# EAGLE design T07 -Schematic V3 (EAGLE 7.7.0)
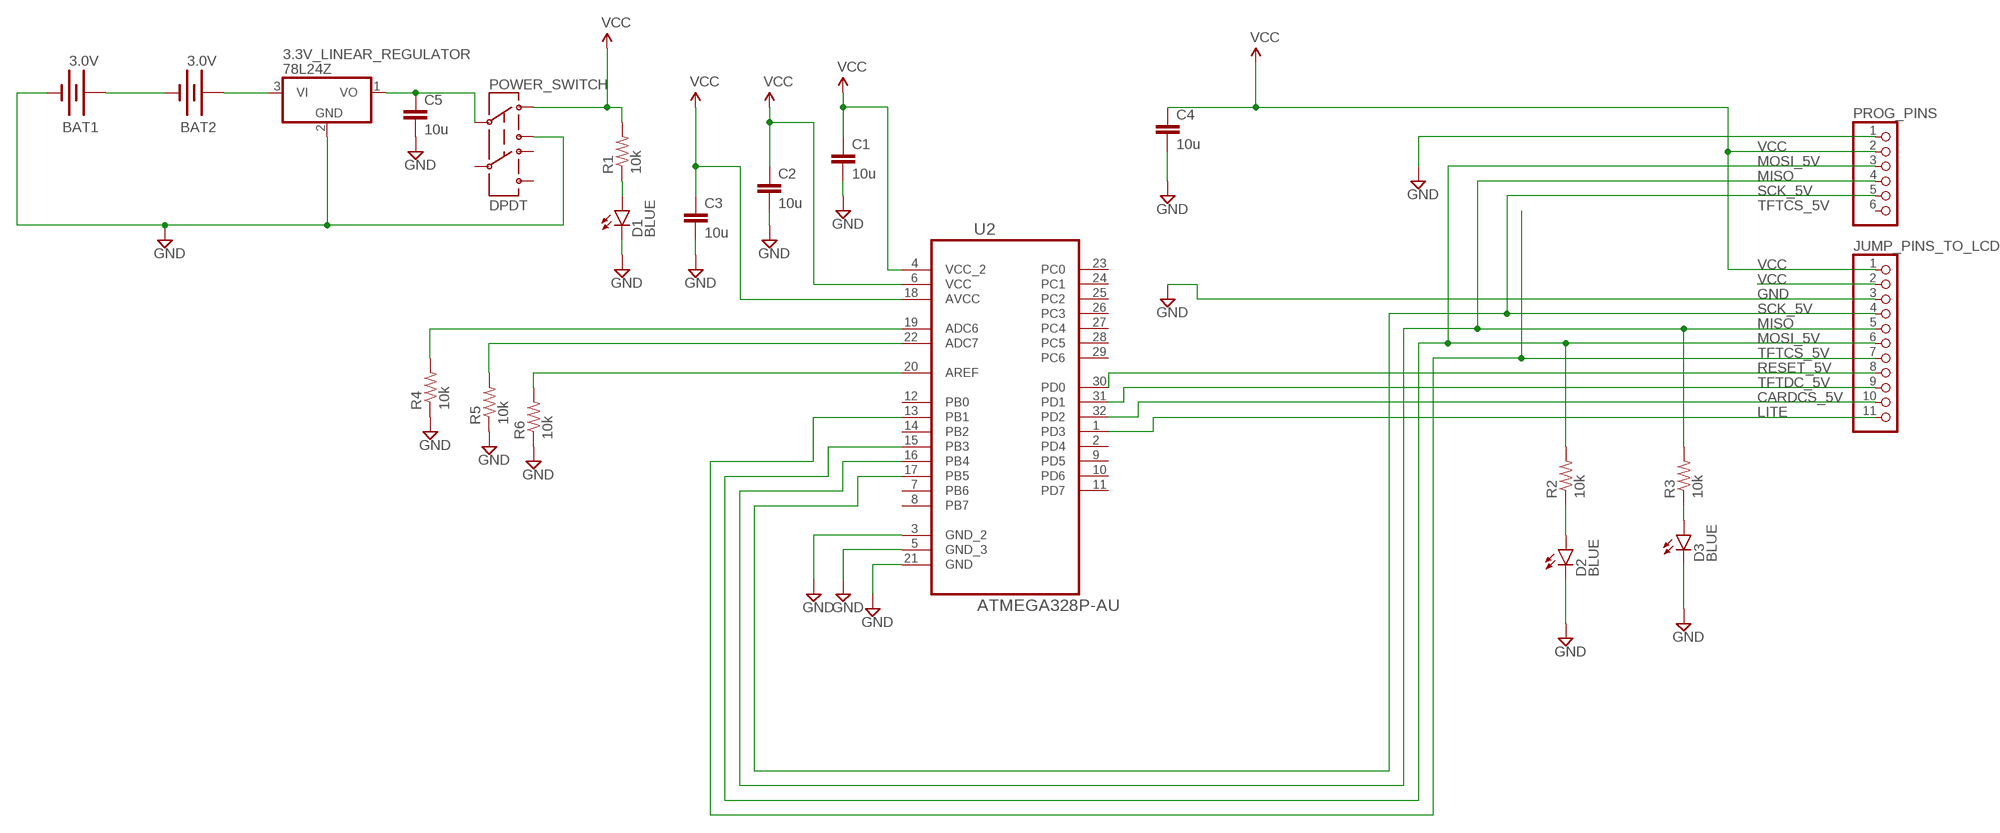
[diagram p0: schematic, sheet 1]

## Parts
3.3V_LINEAR_REGULATOR  78L24Z  [TO92]
BAT1  3.0V  BATTERY245PTH  [BATTCON_245MM_PTH]
BAT2  3.0V  BATTERY245PTH  [BATTCON_245MM_PTH]
C1  10u  CAP1206  [1206]
C2  10u  CAP1206  [1206]
C3  10u  CAP1206  [1206]
C4  10u  CAP1206  [1206]
C5  10u  CAP1206  [1206]
D1  BLUE  LED-BLUE1206  [LED-1206]
D2  BLUE  LED-BLUE1206  [LED-1206]
D3  BLUE  LED-BLUE1206  [LED-1206]
JUMP_PINS_TO_LCD  HEADER-1X1176MIL  [1X11_ROUND_76]
POWER_SWITCH  DPDT  SWITCH-DPDTAYZ0202  [AYZ0202]
PROG_PINS  PINHD-1X6-3.5MM  [1X06-3.5MM]
R1  10k  RESISTOR1206  [1206]
R2  10k  RESISTOR1206  [1206]
R3  10k  RESISTOR1206  [1206]
R4  10k  RESISTOR1206  [1206]
R5  10k  RESISTOR1206  [1206]
R6  10k  RESISTOR1206  [1206]
U2  ATMEGA328P-AU  [QFP80P900X900X120-32N]

## Nets
CARDCS_5V: JUMP_PINS_TO_LCD.10 U2.32(PD2)
GND: 3.3V_LINEAR_REGULATOR.2(GND) BAT1.2(-) C1.2 C2.2 C3.2 C4.2 C5.2 D1.C D2.C D3.C JUMP_PINS_TO_LCD.3 POWER_SWITCH.3 PROG_PINS.1 R4.1 R5.1 R6.1 U2.3(GND_2) U2.5(GND_3) U2.21(GND)
LITE: JUMP_PINS_TO_LCD.11 U2.1(PD3)
MISO: JUMP_PINS_TO_LCD.5 PROG_PINS.4 R3.2 U2.16(PB4)
MOSI_5V: JUMP_PINS_TO_LCD.6 PROG_PINS.3 R2.2 U2.15(PB3)
N$1: BAT1.3(+) BAT2.2(-)
N$2: 3.3V_LINEAR_REGULATOR.3(VI) BAT2.3(+)
N$3: D1.A R1.1
N$4: JUMP_PINS_TO_LCD.2
N$5: R4.2 U2.19(ADC6)
N$7: 3.3V_LINEAR_REGULATOR.1(VO) C5.1 POWER_SWITCH.2
N$8: D2.A R2.1
N$9: D3.A R3.1
N$10: R5.2 U2.22(ADC7)
N$11: R6.2 U2.20(AREF)
RESET_5V: JUMP_PINS_TO_LCD.8 U2.30(PD0)
SCK_5V: JUMP_PINS_TO_LCD.4 PROG_PINS.5 U2.17(PB5)
TFTCS_5V: JUMP_PINS_TO_LCD.7 U2.13(PB1)
TFTDC_5V: JUMP_PINS_TO_LCD.9 U2.31(PD1)
VCC: C1.1 C2.1 C3.1 C4.1 JUMP_PINS_TO_LCD.1 POWER_SWITCH.1 PROG_PINS.2 R1.2 U2.4(VCC_2) U2.6(VCC) U2.18(AVCC)
Unconnected: POWER_SWITCH.4 POWER_SWITCH.5 POWER_SWITCH.6 PROG_PINS.6 U2.2(PD4) U2.7(PB6) U2.8(PB7) U2.9(PD5) U2.10(PD6) U2.11(PD7) U2.12(PB0) U2.14(PB2) U2.23(PC0) U2.24(PC1) U2.25(PC2) U2.26(PC3) U2.27(PC4) U2.28(PC5) U2.29(PC6)

## Library data of the parts
3.3V_LINEAR_REGULATOR = adafruit:78*: Positive VOLTAGE REGULATOR Added bigger pads to the TO-92 package
BAT1 BAT2 = SparkFun-Electromechanical:BATTERY: Battery Holders Various common sizes : AA, AAA, 18650 (PRT-12895), 20mm coin cell and 12mm coin cell. 20MM_4LEGS, BATT-10373
C1-C5 = SparkFun-Capacitors:CAP: Capacitor Standard 0603 ceramic capacitor, and 0.1" leaded capacitor.
D1-D3 = SparkFun-LED:LED-BLUE: Blue LEDs for production use Various blue LEDs stocked by SparkFun production 0603 - DIO-08575 Rebel - DIO-09553 1206 - DIO-09911; PROD_ID: DIO-09911
JUMP_PINS_TO_LCD = microbuilder:HEADER-1X11
POWER_SWITCH = SparkFun-Electromechanical:SWITCH-DPDT: DPDT Version of the COM-00597; PROD_ID: SWCH-08179
PROG_PINS = adafruit:PINHD-1X6: PIN HEADER
R1-R6 = SparkFun-Resistors:RESISTOR: Resistor Basic schematic elements and footprints for 0603, 1206, and PTH resistors.
U2 = Atmel_By_element14_Batch_1-00:ATMEGA328P-AU: 8-bit Microcontroller with In-System Programmable Flash; MPN: ATMEGA328P-AU; OC_FARNELL: 1715486; OC_NEWARK: 14R4631; PACKAGE: TQFP-32; SUPPLIER: Atmel

## Net classes
1 power: width 0.406 mm

## Board
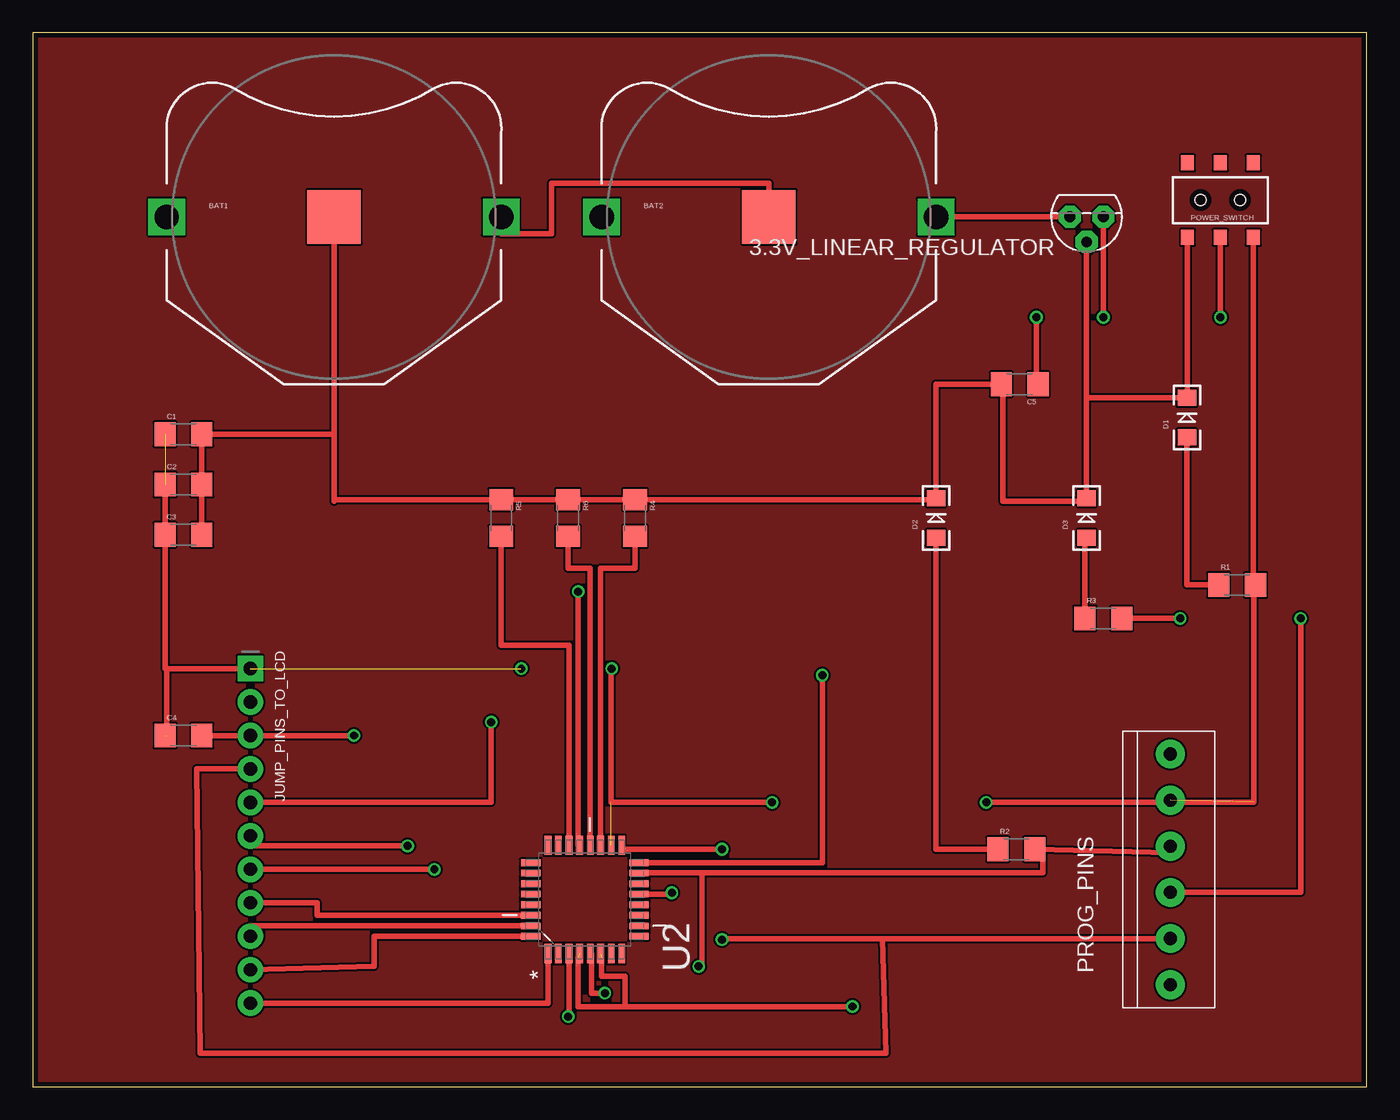
[diagram p1: board, top side]
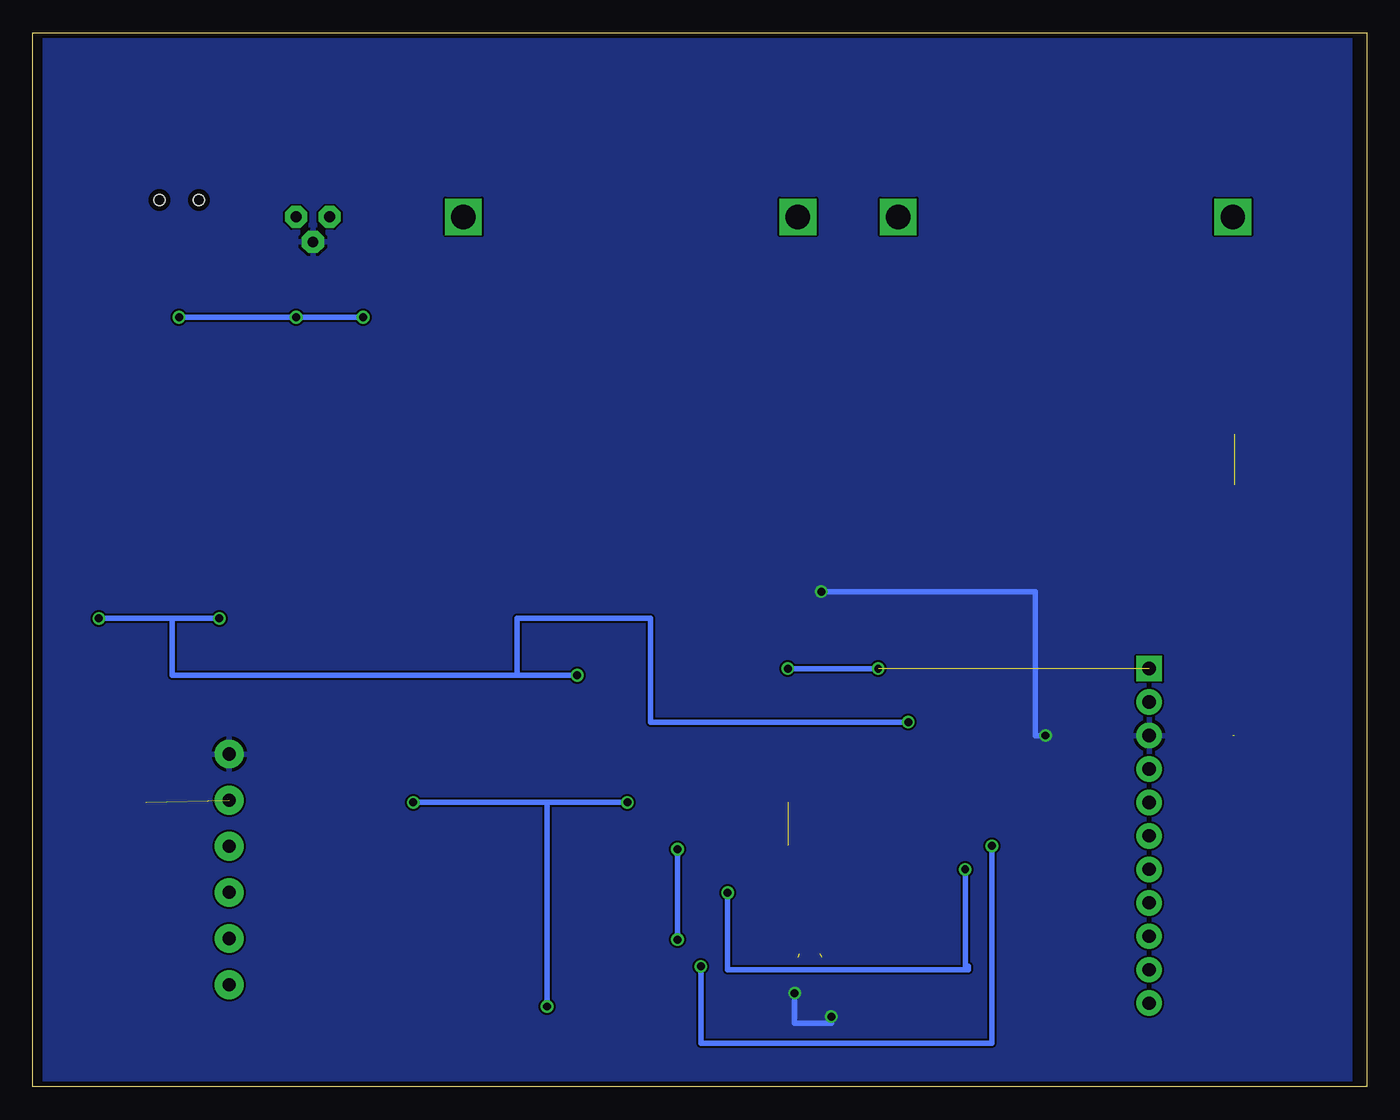
[diagram p2: board, bottom side, seen from below]

Size 101.27 x 80 mm. Coordinates in mm from the lower left corner, seen from the top.
Outline: 0,0 101.27,0 101.27,80 0,80 0,0
Copper layers (1*16): Top 0.0356mm / dielectric 1.5011mm / Bottom 0.0356mm
Design rules "tysons_rules": minimum track width 6mil, minimum drill 13mil, track to track 6mil, track to pad 6mil, pad to pad 6mil, via to via 6mil, smd to smd 6mil, copper to edge 15mil, drill to drill 6mil, minimum pad ring 7mil, minimum via ring 7mil, stop-mask expansion 2.5mil, vias tented up to drill 0mil, thermal gap 10mil

### Footprints (pad centres in the part's own frame; a part is rotated, then mirrored left to right if it is on the bottom)
TO92 = drill 0.813 pad 1.676 octagon: 1 -1.27,0; 2 0,1.905; 3 1.27,0
BATTCON_245MM_PTH = drill 1.854 square: 1 -12.7,0; 3 12.7,0 | smd 4.064 x 4.064: 2 0,0
1206 = smd 1.6 x 1.8: 1 -1.4,0; 2 1.4,0
LED-1206 = smd 1.2 x 1.4: A -1.5,0; C 1.5,0
1X11_ROUND_76 = drill 1 pad 1.93 square: 1 -12.7,0 | drill 1 pad 1.93: 2 -10.16,0; 3 -7.62,0; 4 -5.08,0; 5 -2.54,0; 6 0,0; 7 2.54,0; 8 5.08,0; 9 7.62,0; 10 10.16,0; 11 12.7,0
AYZ0202 = smd 1 x 1.15: 1 -2.5,2.825; 2 0,2.825; 3 2.5,2.825; 4 -2.5,-2.825; 5 0,-2.825; 6 2.5,-2.825 | hole 0.85: 1.5,0; -1.5,0
1X06-3.5MM = drill 1 pad 2.184: 1 -8.75,0; 2 -5.25,0; 3 -1.75,0; 4 1.75,0; 5 5.25,0; 6 8.75,0
QFP80P900X900X120-32N = smd 1.473 x 0.508: 1 -4.115,2.794; 2 -4.115,2.007; 3 -4.115,1.194; 4 -4.115,0.406; 5 -4.115,-0.406; 6 -4.115,-1.194; 7 -4.115,-2.007; 8 -4.115,-2.794; 17 4.115,-2.794; 18 4.115,-2.007; 19 4.115,-1.194; 20 4.115,-0.406; 21 4.115,0.406; 22 4.115,1.194; 23 4.115,2.007; 24 4.115,2.794 | smd 0.508 x 1.473: 9 -2.794,-4.115; 10 -2.007,-4.115; 11 -1.194,-4.115; 12 -0.406,-4.115; 13 0.406,-4.115; 14 1.194,-4.115; 15 2.007,-4.115; 16 2.794,-4.115; 25 2.794,4.115; 26 2.007,4.115; 27 1.194,4.115; 28 0.406,4.115; 29 -0.406,4.115; 30 -1.194,4.115; 31 -2.007,4.115; 32 -2.794,4.115

### Placement (x,y rotation side)
3.3V_LINEAR_REGULATOR  80.01,66.04 180 top
BAT1  22.86,66.04 0 top
BAT2  55.88,66.04 0 top
C1  11.43,49.53 0 top
C2  11.43,45.72 0 top
C3  11.43,41.91 0 top
C4  11.43,26.67 0 top
C5  74.93,53.34 180 top
D1  87.63,50.8 90 top
D2  68.58,43.18 90 top
D3  80.01,43.18 90 top
JUMP_PINS_TO_LCD  16.51,19.05 270 top
POWER_SWITCH  90.17,67.31 180 top
PROG_PINS  86.36,16.51 270 top
R1  91.44,38.1 0 top
R2  74.68,18.03 0 top
R3  81.28,35.56 0 top
R4  45.72,43.18 270 top
R5  35.56,43.18 270 top
R6  40.64,43.18 270 top
U2  41.91,14.22 90 top

### Tracks (layer width: path | path; a pad name or v marks a point on that pad's centre or on a via)
CARDCS_5V
  Top 0.406: U2.32 25.91,11.43 25.91,9.14 JUMP_PINS_TO_LCD.10
GND  (via drill 0.6)
  Top 0.406: BAT1.2 22.86,49.53 | 22.86,49.53 C1.2 | 12.7,49.53 C1.2 | C1.2 C2.2 C3.2 12.7,41.91 | 80.01,52.3 D1.C 87.67,52.3 POWER_SWITCH.3 87.67,64.14 | 80.01,52.3 D3.C 80.01,44.45 73.66,44.45 73.66,53.34 C5.2 68.58,53.34 D2.C 68.58,44.58 R4.1 R6.1 R5.1 22.86,44.58 | 3.3V_LINEAR_REGULATOR.2 80.01,52.3 | 22.86,44.58 22.86,44.45 | 22.86,44.58 22.86,49.53 | C4.2 JUMP_PINS_TO_LCD.3 v24.38,26.67 | U2.21 41.4,18.34 v41.4,37.59 | U2.5 42.42,10.11 42.42,7.11 v43.43,7.11 | v40.64,5.33 40.72,5.33 U2.3
  Bottom 0.406: v24.38,26.67 25.15,26.67 25.15,37.59 v41.4,37.59 | v43.43,7.11 43.43,4.83 40.64,4.83 v40.64,5.33
  pour Bottom: 1.27,80.01 100.33,80.01 100.33,0 1.27,0
LITE
  Top 0.406: U2.1 39.12,6.35 JUMP_PINS_TO_LCD.11
MISO  (via drill 0.6)
  Top 0.406: PROG_PINS.4 96.27,14.76 v96.27,35.56 | v87.12,35.56 R3.2 | U2.16 59.94,17.02 v59.94,31.24 | JUMP_PINS_TO_LCD.5 34.8,21.59 v34.8,27.69
  Bottom 0.406: v96.27,35.56 90.68,35.56 | 90.68,35.56 v87.12,35.56 | v59.94,31.24 64.52,31.24 | 64.52,31.24 90.68,31.24 90.68,35.56 | v34.8,27.69 54.36,27.69 54.36,35.56 64.52,35.56 64.52,31.24
MOSI_5V  (via drill 0.6)
  Top 0.406: PROG_PINS.3 86.36,17.78 R2.2 76.71,17.78 76.71,16.26 50.8,16.26 | 50.8,16.26 46.79,16.26 U2.15 | JUMP_PINS_TO_LCD.6 16.51,18.29 v28.45,18.29 | v50.55,9.14 50.8,9.14 50.8,16.26
  Bottom 0.406: v28.45,18.29 28.45,3.3 50.55,3.3 v50.55,9.14
N$1
  Top 0.406: BAT1.3 35.56,64.77 39.37,64.77 39.37,68.58 55.88,68.58 BAT2.2
N$2
  Top 0.406: BAT2.3 3.3V_LINEAR_REGULATOR.3
N$3
  Top 0.406: D1.A 87.63,38.1 R1.1
N$5
  Top 0.406: R4.2 45.72,39.37 43.1,39.37 U2.19
N$6
  pour Top: 0.51,80.01 101.09,80.01 101.09,-0.25 0.25,-0.25 0.25,0 0.51,0
N$7  (via drill 0.6)
  Top 0.406: C5.1 76.2,53.34 v76.2,58.42 | v81.28,58.42 3.3V_LINEAR_REGULATOR.1 | POWER_SWITCH.2 v90.17,58.42
  Bottom 0.406: v76.2,58.42 v81.28,58.42 v90.17,58.42
N$8
  Top 0.406: D2.A 68.58,18.03 R2.1
N$9
  Top 0.406: D3.A 79.88,41.68 R3.1
N$10
  Top 0.406: R5.2 35.56,33.53 40.72,33.53 U2.22
N$11
  Top 0.406: R6.2 40.64,39.37 42.32,39.37 U2.20
RESET_5V
  Top 0.406: U2.30 21.59,13.03 21.59,13.97 JUMP_PINS_TO_LCD.8
SCK_5V  (via drill 0.6)
  Top 0.406: PROG_PINS.5 64.52,11.26 | 64.52,11.26 64.77,2.54 12.7,2.54 12.45,24.13 JUMP_PINS_TO_LCD.4 | 64.52,11.26 52.32,11.26 v52.32,11.18 | v52.32,18.03 44.7,18.03 U2.17
  Bottom 0.406: v52.32,11.18 v52.32,18.03
TFTCS_5V  (via drill 0.6)
  Top 0.406: U2.13 48.51,14.63 v48.51,14.73 | v30.48,16.51 JUMP_PINS_TO_LCD.7
  Bottom 0.406: v48.51,14.73 48.51,8.89 30.23,8.89 30.23,9.14 30.48,9.14 v30.48,16.51
TFTDC_5V
  Top 0.406: U2.31 16.51,12.22 JUMP_PINS_TO_LCD.9 16.51,10.92
VCC  (via drill 0.6)  (7 unrouted)
  Top 0.406: R1.2 92.71,38.1 | POWER_SWITCH.1 92.67,38.1 92.71,38.1 | 92.71,38.1 92.71,21.59 v72.39,21.59 | v43.94,31.75 43.92,31.75 43.92,21.59 v56.13,21.59 | 44.96,6.1 41.4,6.1 41.4,9.86 | 44.96,6.1 v62.23,6.1 | 43.18,9.86 43.18,8.38 44.96,8.38 44.96,6.1 | 10.16,45.72 C2.1 C3.1 10.03,31.75 10.16,31.75 | JUMP_PINS_TO_LCD.1 10.16,31.75 | 10.16,26.67 10.16,31.75
  Bottom 0.406: v37.08,31.75 v43.94,31.75 | v72.39,21.59 62.23,21.59 | 62.23,21.59 v56.13,21.59 | v62.23,6.1 62.23,21.59